# Altium project Fuel Cell Monitor Master.PrjPcb (part 1 of 2)
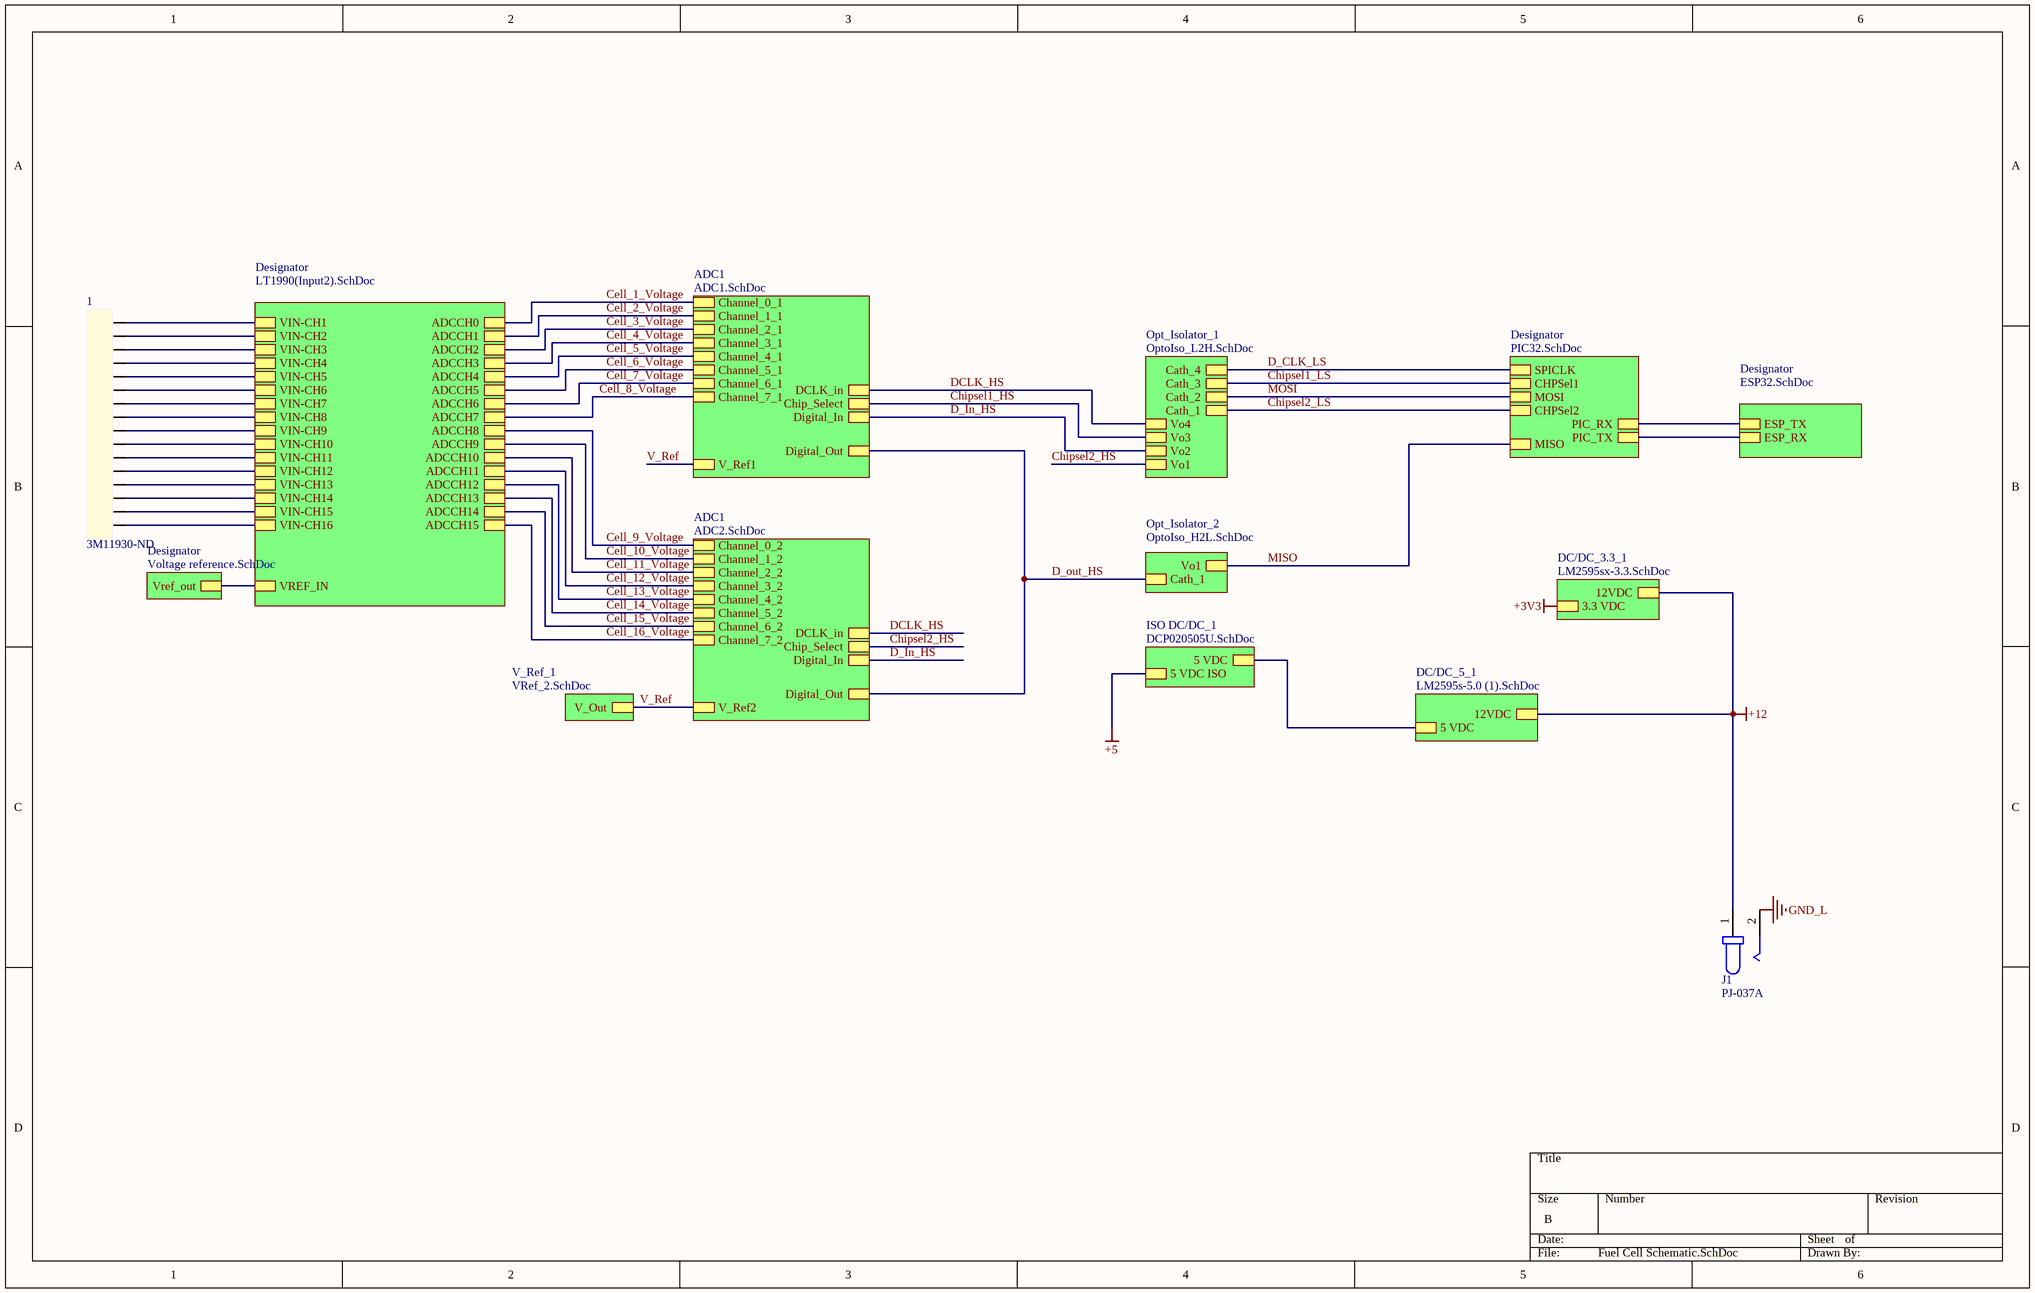
[diagram p0: Fuel Cell Schematic.SchDoc]
11 sheets, 145 parts. Net scope: hierarchical (ports join the sheet entries above them; power ports are global).
Board file: FCM_Integrated.PcbDoc
Sheets:
  Fuel Cell Schematic.SchDoc
    ADC1 = ADC1.SchDoc
    Opt_Isolator_1 = OptoIso_L2H.SchDoc
    Opt_Isolator_2 = OptoIso_H2L.SchDoc
    ADC1 = ADC2.SchDoc
    V_Ref_1 = VRef_2.SchDoc
    Designator = LT1990(Input2).SchDoc
    Designator = Voltage reference.SchDoc
    DC/DC_3.3_1 = LM2595sx-3.3.SchDoc
    ISO DC/DC_1 = DCP020505U.SchDoc
    Designator = PIC32.SchDoc

## Sheet Fuel Cell Schematic.SchDoc
size B; SheetNumber: 1; SheetTotal: 13

### Parts
1  Supplier Part Number 1: 3M11930-ND  [IDC Connector_16POS_2Layer]
J1  PJ-037A  [CUI_PJ-037A]

### Sub-sheets
ADC1 = ADC1.SchDoc: DCLK_in, Chip_Select, Digital_In, Digital_Out, Channel_0_1, Channel_1_1, Channel_2_1, Channel_3_1, Channel_4_1, Channel_5_1, Channel_6_1, Channel_7_1, V_Ref1
ADC1 = ADC2.SchDoc: DCLK_in, Chip_Select, Digital_In, Digital_Out, Channel_0_2, Channel_1_2, Channel_2_2, Channel_3_2, Channel_4_2, Channel_5_2, Channel_6_2, Channel_7_2, V_Ref2
DC/DC_3.3_1 = LM2595sx-3.3.SchDoc: 12VDC, 3.3 VDC
DC/DC_5_1 = LM2595s-5.0 (1).SchDoc (file not in this document): 12VDC, 5 VDC
Designator = LT1990(Input2).SchDoc: ADCCH1, ADCCH2, ADCCH3, VIN-CH3, ADCCH4, VIN-CH4, VIN-CH5, ADCCH5, VIN-CH6, ADCCH6, ADCCH7, ADCCH8, VIN-CH8, ADCCH9, VIN-CH9, ADCCH10, VIN-CH10, ADCCH11, VIN-CH11, ADCCH12, VIN-CH12, ADCCH13, VIN-CH13, ADCCH14, VIN-CH14, ADCCH15, VIN-CH15, VIN-CH16, VIN-CH2, ADCCH0, VIN-CH1, VREF_IN, VIN-CH7
Designator = Voltage reference.SchDoc: Vref_out
Designator = ESP32.SchDoc (file not in this document): ESP_TX, ESP_RX
Designator = PIC32.SchDoc: CHPSel2, MOSI, CHPSel1, PIC_TX, PIC_RX, MISO, SPICLK
ISO DC/DC_1 = DCP020505U.SchDoc: 5 VDC, 5 VDC ISO
Opt_Isolator_1 = OptoIso_L2H.SchDoc: Vo4, Vo3, Vo2, Cath_4, Cath_3, Cath_2, Cath_1, Vo1
Opt_Isolator_2 = OptoIso_H2L.SchDoc: Cath_1, Vo1
V_Ref_1 = VRef_2.SchDoc: V_Out

### Nets
+12: J1.1 ; sheet DC/DC_3.3_1/12VDC, sheet DC/DC_5_1/12VDC
GND_L: J1.2
2.048_VDC: sheet Designator/VREF_IN, sheet Designator/Vref_out
Cell_1_Voltage: sheet ADC1/Channel_0_1, sheet Designator/ADCCH0
Cell_2_Voltage: sheet ADC1/Channel_1_1, sheet Designator/ADCCH1
Cell_3_Voltage: sheet ADC1/Channel_2_1, sheet Designator/ADCCH2
Cell_4_Voltage: sheet ADC1/Channel_3_1, sheet Designator/ADCCH3
Cell_5_Voltage: sheet ADC1/Channel_4_1, sheet Designator/ADCCH4
Cell_6_Voltage: sheet ADC1/Channel_5_1, sheet Designator/ADCCH5
Cell_7_Voltage: sheet ADC1/Channel_6_1, sheet Designator/ADCCH6
Cell_8_Voltage: sheet ADC1/Channel_7_1, sheet Designator/ADCCH7
Cell_9_Voltage: sheet ADC1/Channel_0_2, sheet Designator/ADCCH8
Cell_10_Voltage: sheet ADC1/Channel_1_2, sheet Designator/ADCCH9
Cell_11_Voltage: sheet ADC1/Channel_2_2, sheet Designator/ADCCH10
Cell_12_Voltage: sheet ADC1/Channel_3_2, sheet Designator/ADCCH11
Cell_13_Voltage: sheet ADC1/Channel_4_2, sheet Designator/ADCCH12
Cell_14_Voltage: sheet ADC1/Channel_5_2, sheet Designator/ADCCH13
Cell_15_Voltage: sheet ADC1/Channel_6_2, sheet Designator/ADCCH14
Cell_16_Voltage: sheet ADC1/Channel_7_2, sheet Designator/ADCCH15
Chipsel1_HS: sheet ADC1/Chip_Select, sheet Opt_Isolator_1/Vo3
Chipsel1_LS: sheet Opt_Isolator_1/Cath_3, sheet Designator/CHPSel1
Chipsel2_HS: sheet Opt_Isolator_1/Vo1, sheet ADC1/Chip_Select
Chipsel2_LS: sheet Opt_Isolator_1/Cath_1, sheet Designator/CHPSel2
D_CLK_LS: sheet Opt_Isolator_1/Cath_4, sheet Designator/SPICLK
D_In_HS: sheet ADC1/Digital_In, sheet Opt_Isolator_1/Vo2, sheet ADC1/Digital_In
D_out_HS: sheet ADC1/Digital_Out, sheet Opt_Isolator_2/Cath_1, sheet ADC1/Digital_Out
DCLK_HS: sheet ADC1/DCLK_in, sheet Opt_Isolator_1/Vo4, sheet ADC1/DCLK_in
ESPout-PICin: sheet Designator/ESP_TX, sheet Designator/PIC_RX
MISO: sheet Opt_Isolator_2/Vo1, sheet Designator/MISO  [project net D_out_1L]
MOSI: sheet Opt_Isolator_1/Cath_2, sheet Designator/MOSI  [project net D_in_LS]
PICout-ESPin: sheet Designator/ESP_RX, sheet Designator/PIC_TX
V_Ref: sheet ADC1/V_Ref1, sheet ADC1/V_Ref2, sheet V_Ref_1/V_Out
Net1_1: 1.1 ; sheet Designator/VIN-CH1
Net1_2: 1.2 ; sheet Designator/VIN-CH2
Net1_3: 1.3 ; sheet Designator/VIN-CH3
Net1_4: 1.4 ; sheet Designator/VIN-CH4
Net1_5: 1.5 ; sheet Designator/VIN-CH5
Net1_6: 1.6 ; sheet Designator/VIN-CH6
Net1_7: 1.7 ; sheet Designator/VIN-CH7
Net1_8: 1.8 ; sheet Designator/VIN-CH8
Net1_9: 1.9 ; sheet Designator/VIN-CH9
Net1_10: 1.10 ; sheet Designator/VIN-CH10
Net1_11: 1.11 ; sheet Designator/VIN-CH11
Net1_12: 1.12 ; sheet Designator/VIN-CH12
Net1_13: 1.13 ; sheet Designator/VIN-CH13
Net1_14: 1.14 ; sheet Designator/VIN-CH14
Net1_15: 1.15 ; sheet Designator/VIN-CH15
Net1_16: 1.16 ; sheet Designator/VIN-CH16
NetC9#2_1: sheet ISO DC/DC_1/5 VDC, sheet DC/DC_5_1/5 VDC

### Library data of the parts
1 = 30316-5002HB: Conn Shrouded Header (4 Sides) HDR 16 POS 2.54mm Solder RA Side Entry Thru-Hole Box; Manufacturer: 3M; Gender: Male; Current Rating: 1A; Number of Positions: 16; Connector Type: Male Pin; Row Spacing: 0.1inch; Supplier 1: Digi-Key; Manufacturer Part Number: 30316-5002HB; RoHS: Yes; Category: Connectors; Stock 1: 5922; Pricing 1: 1=1.55000, 10=1.35200, 100=1.20850, 500=1.00712, 1000=0.86325, 5000=0.76541, 10000=0.74815 (USD); Mounting Technology: Through Hole; Contact Plating: Gold; Contact Material: Brass; Color: Black; Housing Material: Polyester; Housing Color: Black; Min Operating Temperature: -55°C; Max Operating Temperature: 105°C; Number of Rows: 2; Termination: Solder; Package Quantity: 1000; Packaging: Bulk; Series: 303; Contact Type: Male Pin; Orientation: Right Angle; Max Current Rating: 1A; Length: 27.9mm; Pitch: 2.54mm; Contact Mating Length: 0.236inch; Depth: 13.26mm; Lead Free: Lead Free; RoHS Compliant: Yes; ComponentLink1URL: https://datasheet.ciiva.com/6832/ts0818-6832733.pdf?src-supplier=Digi-Key; ComponentLink1Description: https://datasheet.ciiva.com/6832/ts0818-6832733.pdf?src-supplier=Digi-Key
J1 = PJ-037A: 2.0 mm Center Pin, 2.5 A, Right Angle, Through Hole, Dc Power Jack Connector; Value: *; Price: None; MP: PJ-037A; Availability: Unavailable; Package: None

## Sheet ADC1.SchDoc
size A; SheetNumber: 7; SheetTotal: 11
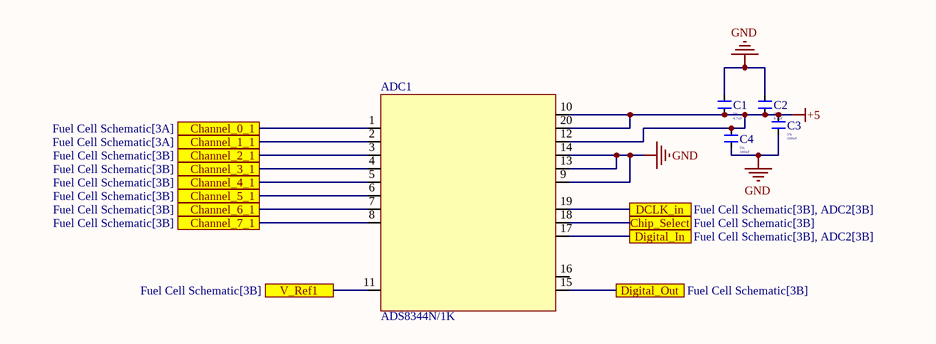
[diagram p1: ADC1.SchDoc]

### Parts
ADC1  ADS8344N/1K  [ADS8344]
C1  Tolerance: 5%  Capacitance: 4.7uF  [Capacitor_Kemet_0805]
C2  Tolerance: 5%  Capacitance: 4.7uF  [Capacitor_Kemet_0805]
C3  Dissipation Factor: 5%  Capacitance: 100nF  [Capacitor_Kemet_0805]
C4  Dissipation Factor: 5%  Capacitance: 100nF  [Capacitor_Kemet_0805]

### Ports
Channel_0_1 (see Fuel Cell Schematic[3A]), Channel_1_1 (see Fuel Cell Schematic[3A]), Channel_2_1 (see Fuel Cell Schematic[3B]), Channel_3_1 (see Fuel Cell Schematic[3B]), Channel_4_1 (see Fuel Cell Schematic[3B]), Channel_5_1 (see Fuel Cell Schematic[3B]), Channel_6_1 (see Fuel Cell Schematic[3B]), Channel_7_1 (see Fuel Cell Schematic[3B]), Chip_Select (see Fuel Cell Schematic[3B]), DCLK_in (see Fuel Cell Schematic[3B], ADC2[3B]), Digital_In (see Fuel Cell Schematic[3B], ADC2[3B]), Digital_Out (see Fuel Cell Schematic[3B]), V_Ref1 (see Fuel Cell Schematic[3B])

### Nets
+5: ADC1.10(Shutdown) ADC1.12(+VCC) ADC1.20(+VCC) C1.1 C2.1 C3.2 C4.2  [project net +5 ISO]
GND: ADC1.9(Common_Reference) ADC1.13(Ground) ADC1.14(Ground) C1.2 C2.2 C3.1 C4.1
Cell_1_Voltage: ADC1.1(Channel_0) ; port Channel_0_1
Cell_2_Voltage: ADC1.2(Channel_1) ; port Channel_1_1
Cell_3_Voltage: ADC1.3(Channel_2) ; port Channel_2_1
Cell_4_Voltage: ADC1.4(Channel_3) ; port Channel_3_1
Cell_5_Voltage: ADC1.5(Channel_4) ; port Channel_4_1
Cell_6_Voltage: ADC1.6(Channel_5) ; port Channel_5_1
Cell_7_Voltage: ADC1.7(Channel_6) ; port Channel_6_1
Cell_8_Voltage: ADC1.8(Channel_7) ; port Channel_7_1
Chipsel1_HS: ADC1.18(Chip_Select) ; port Chip_Select
D_In_HS: ADC1.17(Digital_In) ; port Digital_In
D_out_HS: ADC1.15(Digital_Out) ; port Digital_Out
DCLK_HS: ADC1.19(Digital_Clock) ; port DCLK_in
V_Ref: ADC1.11(V_Reference) ; port V_Ref1

Not connected (* = marked no-connect by the designer): ADC1 16(Busy)

### Library data of the parts
ADC1 = ADS8344N/1K: IC ADC 16BIT SAR 20SSOP; Manufacturer: Texas Instruments; Nominal Supply Current: 1.5mA; Min Supply Voltage: 2.7V; Max Supply Voltage: 5.25V; Max Power Dissipation: 10mW; Interface: Serial; Number of Bits: 16; Sampling Rate: 100KS/s; Number of Converters: 1; Resolution: 16b; Polarity: Unipolar; Number of Inputs: 8; Integral Nonlinearity (INL): 6LSB; Spurious-free dynamic range (SFDR): 92dB; Power Consumption: 3.6mW; Supply Type: Single; Differential Nonlinearity: 2LSB; Power Dissipation: 7.5mW; Operating Supply Voltage: 5V; Supplier 1: Digi-Key; Manufacturer Part Number: ADS8344N/1K; RoHS: Yes; Category: Analog to Digital Converters (ADCs); Stock 1: 1147; Pricing 1: 1=18.10000, 10=16.63400, 25=15.94480, 100=14.04870, 250=13.35924, 500=13.00960 (USD); Case/Package: SSOP; Number of Pins: 20; Contact Plating: Gold; Min Operating Temperature: -40°C; Max Operating Temperature: 85°C; Packaging: Tape and Reel; Package Quantity: 1000; Number of A/D Converters: 1; Conversion Rate: 100KS/s; Max Supply Voltage (DC): 5.25V; Min Supply Voltage (DC): 2.7V; Series: -; Supply Current: 1.5mA; REACH SVHC: No SVHC; Lead Free: Lead Free; RoHS Compliant: Yes; ComponentLink1URL: https://datasheet.ciiva.com/4031/2422049s9164356n7713-4031078.pdf?src-supplier=Arrow+Electronics; ComponentLink1Description: https://datasheet.ciiva.com/4031/2422049s9164356n7713-4031078.pdf?src-supplier=Arrow+Electronics; ComponentLink2URL: https://datasheet.ciiva.com/1308/ads8344-1308384.pdf?src-supplier=Digi-Key; ComponentLink2Description: https://datasheet.ciiva.com/1308/ads8344-1308384.pdf?src-supplier=Digi-Key; Supplier Part Number 1: 296-41197-1-ND
C1 C2 = C0805C475J4RACAUTO: CAP CER 4.7UF 16V X7R 0805; Manufacturer: KEMET; Supplier 1: Digi-Key; RoHS: Yes; Category: Ceramic Capacitors; Stock 1: 16673; Pricing 1: 1=0.56000, 10=0.39300, 50=0.29680, 100=0.25850, 500=0.19150, 1000=0.16277 (USD); Mount: Surface Mount; Case/Package: 0805; Min Operating Temperature: -55°C; Max Operating Temperature: 125°C; Packaging: Tape and Reel; Voltage Rating: 16V; Ratings: AEC-Q200; RoHS Compliant: Yes; ComponentLink1URL: http://www.farnell.com/datasheets/2741387.pdf?src-supplier=Farnell; ComponentLink1Description: http://www.farnell.com/datasheets/2741387.pdf?src-supplier=Farnell; ComponentLink2URL: https://api.kemet.com/component-edge/download/datasheet/C0805C475J4RACAUTO.pdf?src-supplier=Digi-Key; ComponentLink2Description: https://api.kemet.com/component-edge/download/datasheet/C0805C475J4RACAUTO.pdf?src-supplier=Digi-Key; ComponentLink3URL: http://www.farnell.com/datasheets/2741387.pdf?src-supplier=Newark; ComponentLink3Description: http://www.farnell.com/datasheets/2741387.pdf?src-supplier=Newark; Supplier Part Number 1: 399-15716-1-ND; Manufacturer Part Number: C0805C475J4RACAUTO
C3 C4 = C0805C104J4RACTU: Cap Ceramic 0.1uF 16V X7R 5% SMD 0805 125°C Plastic T/R; Manufacturer: KEMET; Supplier 1: Digi-Key; Manufacturer Part Number: C0805C104J4RACTU; RoHS: Yes; Category: Ceramic Capacitors; Stock 1: 21669; Pricing 1: 1=0.53000, 10=0.37300, 50=0.28180, 100=0.24540, 500=0.18180, 1000=0.15453 (USD); Mount: Surface Mount; Case/Package: 0805; Case Code (Imperial): 0805; Case Code (Metric): 2012; Dielectric Material: Ceramic; Min Operating Temperature: -55°C; Max Operating Temperature: 125°C; Package Quantity: 4000; Packaging: Tape and Reel; Voltage Rating: 16V; Voltage Rating (DC): 16V; Dielectric: X7R; Termination: SMD/SMT; Series: -; Length: 2mm; Width: 1.2mm; Height: 0.9mm; Lead Pitch: 0.75mm; Thickness: 0.035inch; Depth: 1.25mm; RoHS Compliant: Yes; ComponentLink1URL: http://www.farnell.com/datasheets/2746326.pdf?src-supplier=Farnell; ComponentLink1Description: http://www.farnell.com/datasheets/2746326.pdf?src-supplier=Farnell; ComponentLink2URL: http://www.farnell.com/datasheets/2323359.pdf?src-supplier=Farnell; ComponentLink2Description: http://www.farnell.com/datasheets/2323359.pdf?src-supplier=Farnell; ComponentLink3URL: http://www.mouser.com/ds/2/212/KEM_C1002_X7R_SMD-1102033.pdf?src-supplier=Mouser; ComponentLink3Description: http://www.mouser.com/ds/2/212/KEM_C1002_X7R_SMD-1102033.pdf?src-supplier=Mouser; ComponentLink4URL: http://components.arrow.com/part/dataview/3452184S4481915N7429?src-supplier=Arrow+Electronics; ComponentLink4Description: http://components.arrow.com/part/dataview/3452184S4481915N7429?src-supplier=Arrow+Electronics; ComponentLink5URL: https://api.kemet.com/component-edge/download/datasheet/C0805C104J4RACTU.pdf?src-supplier=Digi-Key; ComponentLink5Description: https://api.kemet.com/component-edge/download/datasheet/C0805C104J4RACTU.pdf?src-supplier=Digi-Key; ComponentLink6URL: http://www.farnell.com/datasheets/2330568.pdf?src-supplier=Newark; ComponentLink6Description: http://www.farnell.com/datasheets/2330568.pdf?src-supplier=Newark; ComponentLink7URL: http://www.farnell.com/datasheets/2746326.pdf?src-supplier=Newark; ComponentLink7Description: http://www.farnell.com/datasheets/2746326.pdf?src-supplier=Newark; Supplier Part Number 1: 399-C0805C104J4RAC7800CT-ND

## Sheet OptoIso_L2H.SchDoc
size A; SheetNumber: 8; SheetTotal: 11
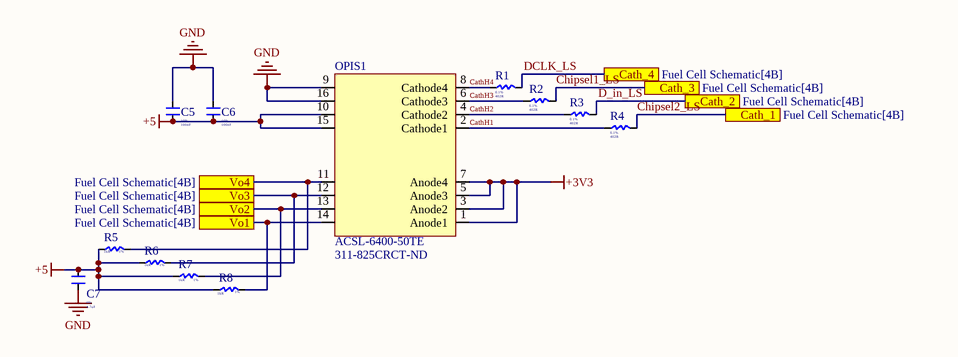
[diagram p2: OptoIso_L2H.SchDoc]

### Parts
(Parts that share a designator on the sheet are numbered #1, #2 ... from top to bottom, then left to right.)
C5#1  Tolerance: 10%  Capacitance: 100nF  [Capacitor_Kemet_0805]
C6#1  Tolerance: 10%  Capacitance: 100nF  [Capacitor_Kemet_0805]
C7#1  Tolerance: 5%  Capacitance: 4.7uF  [Capacitor_Kemet_0805]
OPIS1  Supplier Part Number 2: 311-825CRCT-ND  [Opto_Isolator_ACSL6400_50TE]
R1#1  Tolerance: 0.1%  Resistance: 402R  [LowR_Yageo]
R2#1  Tolerance: 0.1%  Resistance: 402R  [LowR_Yageo]
R3#1  Tolerance: 0.1%  Resistance: 402R  [LowR_Yageo]
R4#1  Tolerance: 0.1%  Resistance: 402R  [LowR_Yageo]
R5#1  Resistance: 1kR  Tolerance: 1%  [Resistor_YAGEO_0805]
R6#1  Resistance: 1kR  Tolerance: 1%  [Resistor_YAGEO_0805]
R7#1  Resistance: 1kR  Tolerance: 1%  [Resistor_YAGEO_0805]
R8#1  Resistance: 1kR  Tolerance: 1%  [Resistor_YAGEO_0805]

### Ports
Cath_1 (see Fuel Cell Schematic[4B]), Cath_2 (see Fuel Cell Schematic[4B]), Cath_3 (see Fuel Cell Schematic[4B]), Cath_4 (see Fuel Cell Schematic[4B]), Vo1 (see Fuel Cell Schematic[4B]), Vo2 (see Fuel Cell Schematic[4B]), Vo3 (see Fuel Cell Schematic[4B]), Vo4 (see Fuel Cell Schematic[4B])

### Nets
+3V3: OPIS1.1(Anode1) OPIS1.3(Anode2) OPIS1.5(Anode3) OPIS1.7(Anode4)
+5: C5#1.2 C6#1.2 C7#1.2 OPIS1.10(VDD) OPIS1.15(VDD) R5#1.1 R6#1.1 R7#1.1 R8#1.1  [project net +5 ISO]
GND: C5#1.1 C6#1.1 C7#1.1 OPIS1.9(Ground) OPIS1.16(Ground)
CathH1: OPIS1.2(Cathode1) R4#1.1
CathH2: OPIS1.4(Cathode2) R3#1.1
CathH3: OPIS1.6(Cathode3) R2#1.1
CathH4: OPIS1.8(Cathode4) R1#1.1
Chipsel1_HS: OPIS1.12(Vo3) R6#1.2 ; port Vo3
Chipsel1_LS: R2#1.2 ; port Cath_3
Chipsel2_HS: OPIS1.14(Vo1) R8#1.2 ; port Vo1
Chipsel2_LS: R4#1.2 ; port Cath_1
D_In_HS: OPIS1.13(Vo2) R7#1.2 ; port Vo2
D_in_LS: R3#1.2 ; port Cath_2
DCLK_HS: OPIS1.11(Vo4) R5#1.2 ; port Vo4
DCLK_LS: R1#1.2 ; port Cath_4  [project net D_CLK_LS]

### Library data of the parts
C5#1 C6#1 = C0805C104K6RACTU: Cap Ceramic 0.1uF 35V X7R 10% SMD 0805 125°C Paper T/R; Manufacturer: KEMET; Supplier 1: Digi-Key; Manufacturer Part Number: C0805C104K6RACTU; RoHS: Yes; Category: Ceramic Capacitors; Stock 1: 14662; Pricing 1: 1=0.44000, 10=0.30300, 50=0.21200, 100=0.18180, 500=0.13636, 1000=0.11514 (USD); Mount: Surface Mount; Case/Package: 0805; Dielectric Material: Ceramic; Min Operating Temperature: -55°C; Max Operating Temperature: 125°C; Packaging: Tape and Reel; Dielectric: X7R; Voltage Rating (DC): 35V; Construction: Flat; Length: 2mm; Height: 0.9mm; Depth: 1.25mm; Radiation Hardening: No; RoHS Compliant: Yes; ComponentLink1URL: http://www.kemet.com/kemet/web/homepage/kechome.nsf/weben/C4DA2DA1D1C9D3C3CA2570A50016092D/$file/KEM_C1002_X7R_SMD.pdf?src-supplier=Avnet; ComponentLink1Description: http://www.kemet.com/kemet/web/homepage/kechome.nsf/weben/C4DA2DA1D1C9D3C3CA2570A50016092D/$file/KEM_C1002_X7R_SMD.pdf?src-supplier=Avnet; ComponentLink2URL: https://api.kemet.com/component-edge/download/datasheet/C0805C104K6RAC7800.pdf?src-supplier=Digi-Key; ComponentLink2Description: https://api.kemet.com/component-edge/download/datasheet/C0805C104K6RAC7800.pdf?src-supplier=Digi-Key; Supplier Part Number 1: 399-17618-1-ND
C7#1 = C0805C475J4RACAUTO: as C1 on sheet ADC1; Supplier 1: Digi-Key; RoHS: Yes; Category: Ceramic Capacitors; Stock 1: 16673; Pricing 1: 1=0.56000, 10=0.39300, 50=0.29680, 100=0.25850, 500=0.19150, 1000=0.16277 (USD); Mount: Surface Mount; Case/Package: 0805; Min Operating Temperature: -55°C; Max Operating Temperature: 125°C; Packaging: Tape and Reel; Voltage Rating: 16V; Ratings: AEC-Q200; RoHS Compliant: Yes; ComponentLink1URL: http://www.farnell.com/datasheets/2741387.pdf?src-supplier=Farnell; ComponentLink1Description: http://www.farnell.com/datasheets/2741387.pdf?src-supplier=Farnell; ComponentLink2URL: https://api.kemet.com/component-edge/download/datasheet/C0805C475J4RACAUTO.pdf?src-supplier=Digi-Key; ComponentLink2Description: https://api.kemet.com/component-edge/download/datasheet/C0805C475J4RACAUTO.pdf?src-supplier=Digi-Key; ComponentLink3URL: http://www.farnell.com/datasheets/2741387.pdf?src-supplier=Newark; ComponentLink3Description: http://www.farnell.com/datasheets/2741387.pdf?src-supplier=Newark; Supplier Part Number 1: 399-15716-1-ND; Manufacturer Part Number: C0805C475J4RACAUTO
OPIS1 = ACSL-6400-50TE: OPTOISO 2.5KV 4CH OPEN COLL 16SO; Manufacturer: Broadcom Avago; Forward Voltage: 1.8V; Forward Current: 15mA; Output Current: 50mA; Propagation Delay: 100ns; Reverse Breakdown Voltage: 5V; Max Power Dissipation: 40mW; Rise Time: 35ns; Number of Channels: 4; Fall Time: 12ns; Power Dissipation: 65mW; Data Rate: 15Mbps; Output Voltage: 7V; Input Type: DC; Supplier 1: Digi-Key; RoHS: Yes; Category: Optocouplers; Stock 1: 12687; Pricing 1: 1=10.50000, 10=7.61700, 100=6.29380, 500=5.51204 (USD); Mount: Surface Mount; Case/Package: SOIC; Number of Pins: 16; Contact Plating: Tin,Matte; Min Operating Temperature: -40°C; Max Operating Temperature: 100°C; Packaging: Tape and Reel; Max Output Current: 50mA; Package Quantity: 1000; Output Current per Channel: 50mA; Number of Elements: 4; Turn-On Delay Time: 100ns; Isolation Voltage: 2.5kV; Input Current: 15mA; Series: -; Radiation Hardening: No; REACH SVHC: No SVHC; Lead Free: Lead Free; RoHS Compliant: Yes; ComponentLink1URL: http://components.arrow.com/part/dataview/41316762S9676761N7786?src-supplier=Arrow+Electronics; ComponentLink1Description: http://components.arrow.com/part/dataview/41316762S9676761N7786?src-supplier=Arrow+Electronics; ComponentLink2URL: http://www.farnell.com/datasheets/1790955.pdf?src-supplier=Farnell; ComponentLink2Description: http://www.farnell.com/datasheets/1790955.pdf?src-supplier=Farnell; ComponentLink3URL: https://www.verical.com/server-webapp/html/getDatasheet?partID=300680&src-supplier=Verical; ComponentLink3Description: https://www.verical.com/server-webapp/html/getDatasheet?partID=300680&src-supplier=Verical; ComponentLink4URL: http://www.avagotech.com/docs/AV02-0235EN?src-supplier=Avnet; ComponentLink4Description: http://www.avagotech.com/docs/AV02-0235EN?src-supplier=Avnet; ComponentLink5URL: http://www.avagotech.com/docs/AV02-0235EN?src-supplier=Digi-Key; ComponentLink5Description: http://www.avagotech.com/docs/AV02-0235EN?src-supplier=Digi-Key; ComponentLink6URL: https://docs.broadcom.com/docs/AV02-0235EN?src-supplier=Digi-Key; ComponentLink6Description: https://docs.broadcom.com/docs/AV02-0235EN?src-supplier=Digi-Key; ComponentLink7URL: http://www.farnell.com/datasheets/1790955.pdf?src-supplier=Newark; ComponentLink7Description: http://www.farnell.com/datasheets/1790955.pdf?src-supplier=Newark; ComponentLink8URL: http://www.farnell.com/datasheets/1790955.pdf?src-supplier=Element14; ComponentLink8Description: http://www.farnell.com/datasheets/1790955.pdf?src-supplier=Element14; ComponentLink9URL: http://www.avagotech.com/search/results.jsp?src=&siteCriteria=ACSL6400&src-supplier=Mouser; ComponentLink9Description: http://www.avagotech.com/search/results.jsp?src=&siteCriteria=ACSL6400&src-supplier=Mouser; Supplier Part Number 1: 516-2917-1-ND; Supplier 2: Digi-Key; Manufacturer Part Number: ACSL-6400-50TE
R1#1 R2#1 R3#1 R4#1 = RT0805BRD07402RL: Res Thin Film 0805 402 Ohm 0.1% 1/8W ±25ppm/°C Molded SMD Paper T/R; Manufacturer: Yageo; Voltage Rating: 150V; Power Rating: 125mW; Supplier 1: Digi-Key; Manufacturer Part Number: RT0805BRD07402RL; RoHS: Yes; Category: Chip SMD Resistors; Stock 1: 13492; Pricing 1: 1=0.38000, 10=0.27200, 100=0.10870, 1000=0.05357, 2500=0.04963 (USD); Case/Package: 0805; Case Code (Metric): 2012; Case Code (Imperial): 0805; Min Operating Temperature: -55°C; Max Operating Temperature: 125°C; Packaging: Tape and Reel; Termination: SMD/SMT; Temperature Coefficient: 25ppm/°C; Voltage Rating (DC): 150V; Series: RT; Length: 2mm; Width: 1.25mm; Height: 500um; Lead Free: Lead Free; RoHS Compliant: Yes; ComponentLink1URL: https://datasheet.ciiva.com/12706/pyu-rt-1-to-0-05-rohs-l-4-12706505.pdf?src-supplier=Mouser; ComponentLink1Description: https://datasheet.ciiva.com/12706/pyu-rt-1-to-0-05-rohs-l-4-12706505.pdf?src-supplier=Mouser; Supplier Part Number 1: YAG4897CT-ND
R5#1 R6#1 R7#1 R8#1 = RC0805FR-071KP: Res Thick Film 0805 1K Ohm 1% 0.125W(1/8W) ±100ppm/C Pad SMD T/R; Manufacturer: Yageo; Max Power Dissipation: 125mW; Temperature Coefficient: 100ppm/°C; Supplier 1: Digi-Key; Manufacturer Part Number: RC0805FR-071KP; RoHS: Yes; Category: Chip SMD Resistors; Stock 1: 37560; Pricing 1: 1=0.10000, 10=0.06400, 100=0.02600, 1000=0.01168, 2500=0.01014 (USD); Case/Package: 0805; Case Code (Metric): 2012; Case Code (Imperial): 0805; Min Operating Temperature: -55°C; Max Operating Temperature: 155°C; Packaging: Tape and Reel; Resistor Type: Thick Film; Number of Terminations: 2; Features: Moisture Resistant; Length: 0.079inch; Width: 0.049inch; Height: 0.024inch; RoHS Compliant: Yes; ComponentLink1URL: http://www.yageo.com/NewPortal/yageodocoutput?fileName=/pdf/R-Chip/PYu-RC_51_RoHS_P_0.pdf&src-supplier=Digi-Key; ComponentLink1Description: http://www.yageo.com/NewPortal/yageodocoutput?fileName=/pdf/R-Chip/PYu-RC_51_RoHS_P_0.pdf&src-supplier=Digi-Key; ComponentLink2URL: http://www.yageo.com.tw/exep/pages/download/literatures/PYu-R_INT-thick_7.pdf?src-supplier=Digi-Key; ComponentLink2Description: http://www.yageo.com.tw/exep/pages/download/literatures/PYu-R_INT-thick_7.pdf?src-supplier=Digi-Key; Supplier Part Number 1: YAG1321CT-ND

## Sheet OptoIso_H2L.SchDoc
size A; SheetNumber: 8; SheetTotal: 11
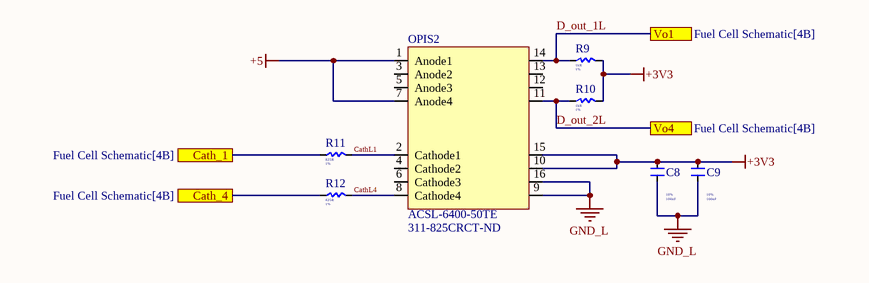
[diagram p3: OptoIso_H2L.SchDoc]

### Parts
(Parts that share a designator on the sheet are numbered #1, #2 ... from top to bottom, then left to right.)
C8#1  Tolerance: 10%  Capacitance: 100nF  [Capacitor_Kemet_0805]
C9#1  Tolerance: 10%  Capacitance: 100nF  [Capacitor_Kemet_0805]
OPIS2  Supplier Part Number 2: 311-825CRCT-ND  [Opto_Isolator_ACSL6400_50TE]
R9#1  Resistance: 1kR  Tolerance: 1%  [Resistor_YAGEO_0805]
R10#1  Resistance: 1kR  Tolerance: 1%  [Resistor_YAGEO_0805]
R11#1  Resistance: 825R  Tolerance: 1%  [Resistor_YAGEO_0805]
R12#1  Resistance: 825R  Tolerance: 1%  [Resistor_YAGEO_0805]

### Ports
Cath_1 (see Fuel Cell Schematic[4B]), Cath_4 (see Fuel Cell Schematic[4B]), Vo1 (see Fuel Cell Schematic[4B]), Vo4 (see Fuel Cell Schematic[4B])

### Nets
+3V3: C8#1.2 C9#1.2 OPIS2.10(VDD) OPIS2.15(VDD) R9#1.2 R10#1.2
+5: OPIS2.1(Anode1) OPIS2.7(Anode4)  [project net +5 ISO]
GND_L: C8#1.1 C9#1.1 OPIS2.9(Ground) OPIS2.16(Ground)
CathL1: OPIS2.2(Cathode1) R11#1.2
CathL4: OPIS2.8(Cathode4) R12#1.2
D_out_1L: OPIS2.14(Vo1) R9#1.1 ; port Vo1
D_out_2L: OPIS2.11(Vo4) R10#1.1 ; port Vo4
D_out_HS: R11#1.1 ; port Cath_1
NetR12#1_1: R12#1.1 ; port Cath_4

Not connected (* = marked no-connect by the designer): OPIS2 3(Anode2) 4(Cathode2) 5(Anode3) 6(Cathode3) 12(Vo3) 13(Vo2)

### Library data of the parts
C8#1 C9#1 = C0805C104K6RACTU: as C5#1 on sheet OptoIso_L2H; Supplier 1: Digi-Key; Manufacturer Part Number: C0805C104K6RACTU; RoHS: Yes; Category: Ceramic Capacitors; Stock 1: 14662; Pricing 1: 1=0.44000, 10=0.30300, 50=0.21200, 100=0.18180, 500=0.13636, 1000=0.11514 (USD); Mount: Surface Mount; Case/Package: 0805; Dielectric Material: Ceramic; Min Operating Temperature: -55°C; Max Operating Temperature: 125°C; Packaging: Tape and Reel; Dielectric: X7R; Voltage Rating (DC): 35V; Construction: Flat; Length: 2mm; Height: 0.9mm; Depth: 1.25mm; Radiation Hardening: No; RoHS Compliant: Yes; ComponentLink1URL: http://www.kemet.com/kemet/web/homepage/kechome.nsf/weben/C4DA2DA1D1C9D3C3CA2570A50016092D/$file/KEM_C1002_X7R_SMD.pdf?src-supplier=Avnet; ComponentLink1Description: http://www.kemet.com/kemet/web/homepage/kechome.nsf/weben/C4DA2DA1D1C9D3C3CA2570A50016092D/$file/KEM_C1002_X7R_SMD.pdf?src-supplier=Avnet; ComponentLink2URL: https://api.kemet.com/component-edge/download/datasheet/C0805C104K6RAC7800.pdf?src-supplier=Digi-Key; ComponentLink2Description: https://api.kemet.com/component-edge/download/datasheet/C0805C104K6RAC7800.pdf?src-supplier=Digi-Key; Supplier Part Number 1: 399-17618-1-ND
OPIS2 = ACSL-6400-50TE: as OPIS1 on sheet OptoIso_L2H; Supplier 1: Digi-Key; RoHS: Yes; Category: Optocouplers; Stock 1: 12687; Pricing 1: 1=10.50000, 10=7.61700, 100=6.29380, 500=5.51204 (USD); Mount: Surface Mount; Case/Package: SOIC; Number of Pins: 16; Contact Plating: Tin,Matte; Min Operating Temperature: -40°C; Max Operating Temperature: 100°C; Packaging: Tape and Reel; Max Output Current: 50mA; Package Quantity: 1000; Output Current per Channel: 50mA; Number of Elements: 4; Turn-On Delay Time: 100ns; Isolation Voltage: 2.5kV; Input Current: 15mA; Series: -; Radiation Hardening: No; REACH SVHC: No SVHC; Lead Free: Lead Free; RoHS Compliant: Yes; ComponentLink1URL: http://components.arrow.com/part/dataview/41316762S9676761N7786?src-supplier=Arrow+Electronics; ComponentLink1Description: http://components.arrow.com/part/dataview/41316762S9676761N7786?src-supplier=Arrow+Electronics; ComponentLink2URL: http://www.farnell.com/datasheets/1790955.pdf?src-supplier=Farnell; ComponentLink2Description: http://www.farnell.com/datasheets/1790955.pdf?src-supplier=Farnell; ComponentLink3URL: https://www.verical.com/server-webapp/html/getDatasheet?partID=300680&src-supplier=Verical; ComponentLink3Description: https://www.verical.com/server-webapp/html/getDatasheet?partID=300680&src-supplier=Verical; ComponentLink4URL: http://www.avagotech.com/docs/AV02-0235EN?src-supplier=Avnet; ComponentLink4Description: http://www.avagotech.com/docs/AV02-0235EN?src-supplier=Avnet; ComponentLink5URL: http://www.avagotech.com/docs/AV02-0235EN?src-supplier=Digi-Key; ComponentLink5Description: http://www.avagotech.com/docs/AV02-0235EN?src-supplier=Digi-Key; ComponentLink6URL: https://docs.broadcom.com/docs/AV02-0235EN?src-supplier=Digi-Key; ComponentLink6Description: https://docs.broadcom.com/docs/AV02-0235EN?src-supplier=Digi-Key; ComponentLink7URL: http://www.farnell.com/datasheets/1790955.pdf?src-supplier=Newark; ComponentLink7Description: http://www.farnell.com/datasheets/1790955.pdf?src-supplier=Newark; ComponentLink8URL: http://www.farnell.com/datasheets/1790955.pdf?src-supplier=Element14; ComponentLink8Description: http://www.farnell.com/datasheets/1790955.pdf?src-supplier=Element14; ComponentLink9URL: http://www.avagotech.com/search/results.jsp?src=&siteCriteria=ACSL6400&src-supplier=Mouser; ComponentLink9Description: http://www.avagotech.com/search/results.jsp?src=&siteCriteria=ACSL6400&src-supplier=Mouser; Supplier Part Number 1: 516-2917-1-ND; Supplier 2: Digi-Key; Manufacturer Part Number: ACSL-6400-50TE
R9#1 R10#1 = RC0805FR-071KP: as R5#1 on sheet OptoIso_L2H; Supplier 1: Digi-Key; Manufacturer Part Number: RC0805FR-071KP; RoHS: Yes; Category: Chip SMD Resistors; Stock 1: 37560; Pricing 1: 1=0.10000, 10=0.06400, 100=0.02600, 1000=0.01168, 2500=0.01014 (USD); Case/Package: 0805; Case Code (Metric): 2012; Case Code (Imperial): 0805; Min Operating Temperature: -55°C; Max Operating Temperature: 155°C; Packaging: Tape and Reel; Resistor Type: Thick Film; Number of Terminations: 2; Features: Moisture Resistant; Length: 0.079inch; Width: 0.049inch; Height: 0.024inch; RoHS Compliant: Yes; ComponentLink1URL: http://www.yageo.com/NewPortal/yageodocoutput?fileName=/pdf/R-Chip/PYu-RC_51_RoHS_P_0.pdf&src-supplier=Digi-Key; ComponentLink1Description: http://www.yageo.com/NewPortal/yageodocoutput?fileName=/pdf/R-Chip/PYu-RC_51_RoHS_P_0.pdf&src-supplier=Digi-Key; ComponentLink2URL: http://www.yageo.com.tw/exep/pages/download/literatures/PYu-R_INT-thick_7.pdf?src-supplier=Digi-Key; ComponentLink2Description: http://www.yageo.com.tw/exep/pages/download/literatures/PYu-R_INT-thick_7.pdf?src-supplier=Digi-Key; Supplier Part Number 1: YAG1321CT-ND
R11#1 R12#1 = RC0805FR-07825RL: 825 Ohms ±1% 0.125W, 1/8W Chip Resistor 0805 (2012 Metric) Moisture Resistant Thick Film; Manufacturer: Yageo; Voltage Rating (DC): 150V; Power Rating: 125mW; Temperature Coefficient: 100ppm/°C; Supplier 1: Digi-Key; Manufacturer Part Number: RC0805FR-07825RL; RoHS: Yes; Category: Chip SMD Resistors; Stock 1: 643539; Pricing 1: 1=0.10000, 10=0.03700, 100=0.01510, 1000=0.00680, 2500=0.00590 (USD); Case/Package: 0805; Case Code (Imperial): 0805; Case Code (Metric): 2012; Contact Plating: Tin,Matte,Lead; Min Operating Temperature: -55°C; Max Operating Temperature: 155°C; Packaging: Tape and Reel; Features: Moisture Resistant; Series: RC; Voltage Rating: 150V; Termination: SMD/SMT; Resistor Type: Thick Film; Number of Terminations: 2; Max Power Dissipation: 125mW; Construction: Rectangular; Working Voltage: 150V; Technology: THICK FILM; Length: 2mm; Depth: 1.25mm; Radiation Hardening: No; Lead Free: Lead Free; RoHS Compliant: Yes; Military Standard: Not; ComponentLink1URL: https://datasheet.ciiva.com/16741/rc0805-16741467.pdf?src-supplier=Future+Electronics; ComponentLink1Description: https://datasheet.ciiva.com/16741/rc0805-16741467.pdf?src-supplier=Future+Electronics; Supplier Part Number 1: 311-825CRCT-ND

## Sheet ADC2.SchDoc
size A; SheetNumber: 11; SheetTotal: 11
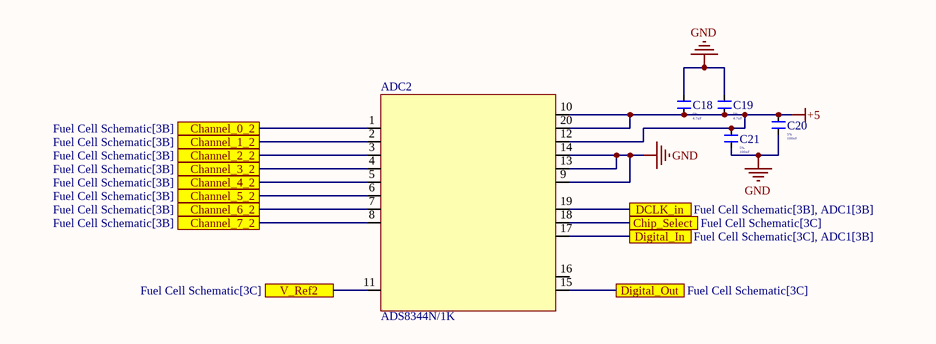
[diagram p4: ADC2.SchDoc]

### Parts
(Parts that share a designator on the sheet are numbered #1, #2 ... from top to bottom, then left to right.)
ADC2  ADS8344N/1K  [ADS8344]
C18#1  Tolerance: 5%  Capacitance: 4.7uF  [Capacitor_Kemet_0805]
C19#1  Tolerance: 5%  Capacitance: 4.7uF  [Capacitor_Kemet_0805]
C20#1  Dissipation Factor: 5%  Capacitance: 100nF  [Capacitor_Kemet_0805]
C21#1  Dissipation Factor: 5%  Capacitance: 100nF  [Capacitor_Kemet_0805]

### Ports
Channel_0_2 (see Fuel Cell Schematic[3B]), Channel_1_2 (see Fuel Cell Schematic[3B]), Channel_2_2 (see Fuel Cell Schematic[3B]), Channel_3_2 (see Fuel Cell Schematic[3B]), Channel_4_2 (see Fuel Cell Schematic[3B]), Channel_5_2 (see Fuel Cell Schematic[3B]), Channel_6_2 (see Fuel Cell Schematic[3B]), Channel_7_2 (see Fuel Cell Schematic[3B]), Chip_Select (see Fuel Cell Schematic[3C]), DCLK_in (see Fuel Cell Schematic[3B], ADC1[3B]), Digital_In (see Fuel Cell Schematic[3C], ADC1[3B]), Digital_Out (see Fuel Cell Schematic[3C]), V_Ref2 (see Fuel Cell Schematic[3C])

### Nets
+5: ADC2.10(Shutdown) ADC2.12(+VCC) ADC2.20(+VCC) C18#1.1 C19#1.1 C20#1.2 C21#1.2  [project net +5 ISO]
GND: ADC2.9(Common_Reference) ADC2.13(Ground) ADC2.14(Ground) C18#1.2 C19#1.2 C20#1.1 C21#1.1
Cell_9_Voltage: ADC2.1(Channel_0) ; port Channel_0_2
Cell_10_Voltage: ADC2.2(Channel_1) ; port Channel_1_2
Cell_11_Voltage: ADC2.3(Channel_2) ; port Channel_2_2
Cell_12_Voltage: ADC2.4(Channel_3) ; port Channel_3_2
Cell_13_Voltage: ADC2.5(Channel_4) ; port Channel_4_2
Cell_14_Voltage: ADC2.6(Channel_5) ; port Channel_5_2
Cell_15_Voltage: ADC2.7(Channel_6) ; port Channel_6_2
Cell_16_Voltage: ADC2.8(Channel_7) ; port Channel_7_2
Chipsel2_HS: ADC2.18(Chip_Select) ; port Chip_Select
D_In_HS: ADC2.17(Digital_In) ; port Digital_In
D_out_HS: ADC2.15(Digital_Out) ; port Digital_Out
DCLK_HS: ADC2.19(Digital_Clock) ; port DCLK_in
V_Ref: ADC2.11(V_Reference) ; port V_Ref2

Not connected (* = marked no-connect by the designer): ADC2 16(Busy)

### Library data of the parts
ADC2 = ADS8344N/1K: as ADC1 on sheet ADC1; Supplier 1: Digi-Key; Manufacturer Part Number: ADS8344N/1K; RoHS: Yes; Category: Analog to Digital Converters (ADCs); Stock 1: 1147; Pricing 1: 1=18.10000, 10=16.63400, 25=15.94480, 100=14.04870, 250=13.35924, 500=13.00960 (USD); Case/Package: SSOP; Number of Pins: 20; Contact Plating: Gold; Min Operating Temperature: -40°C; Max Operating Temperature: 85°C; Packaging: Tape and Reel; Package Quantity: 1000; Number of A/D Converters: 1; Conversion Rate: 100KS/s; Max Supply Voltage (DC): 5.25V; Min Supply Voltage (DC): 2.7V; Series: -; Supply Current: 1.5mA; REACH SVHC: No SVHC; Lead Free: Lead Free; RoHS Compliant: Yes; ComponentLink1URL: https://datasheet.ciiva.com/4031/2422049s9164356n7713-4031078.pdf?src-supplier=Arrow+Electronics; ComponentLink1Description: https://datasheet.ciiva.com/4031/2422049s9164356n7713-4031078.pdf?src-supplier=Arrow+Electronics; ComponentLink2URL: https://datasheet.ciiva.com/1308/ads8344-1308384.pdf?src-supplier=Digi-Key; ComponentLink2Description: https://datasheet.ciiva.com/1308/ads8344-1308384.pdf?src-supplier=Digi-Key; Supplier Part Number 1: 296-41197-1-ND
C18#1 C19#1 = C0805C475J4RACAUTO: as C1 on sheet ADC1; Supplier 1: Digi-Key; RoHS: Yes; Category: Ceramic Capacitors; Stock 1: 16673; Pricing 1: 1=0.56000, 10=0.39300, 50=0.29680, 100=0.25850, 500=0.19150, 1000=0.16277 (USD); Mount: Surface Mount; Case/Package: 0805; Min Operating Temperature: -55°C; Max Operating Temperature: 125°C; Packaging: Tape and Reel; Voltage Rating: 16V; Ratings: AEC-Q200; RoHS Compliant: Yes; ComponentLink1URL: http://www.farnell.com/datasheets/2741387.pdf?src-supplier=Farnell; ComponentLink1Description: http://www.farnell.com/datasheets/2741387.pdf?src-supplier=Farnell; ComponentLink2URL: https://api.kemet.com/component-edge/download/datasheet/C0805C475J4RACAUTO.pdf?src-supplier=Digi-Key; ComponentLink2Description: https://api.kemet.com/component-edge/download/datasheet/C0805C475J4RACAUTO.pdf?src-supplier=Digi-Key; ComponentLink3URL: http://www.farnell.com/datasheets/2741387.pdf?src-supplier=Newark; ComponentLink3Description: http://www.farnell.com/datasheets/2741387.pdf?src-supplier=Newark; Supplier Part Number 1: 399-15716-1-ND; Manufacturer Part Number: C0805C475J4RACAUTO
C20#1 C21#1 = C0805C104J4RACTU: as C3 on sheet ADC1; Supplier 1: Digi-Key; Manufacturer Part Number: C0805C104J4RACTU; RoHS: Yes; Category: Ceramic Capacitors; Stock 1: 21669; Pricing 1: 1=0.53000, 10=0.37300, 50=0.28180, 100=0.24540, 500=0.18180, 1000=0.15453 (USD); Mount: Surface Mount; Case/Package: 0805; Case Code (Imperial): 0805; Case Code (Metric): 2012; Dielectric Material: Ceramic; Min Operating Temperature: -55°C; Max Operating Temperature: 125°C; Package Quantity: 4000; Packaging: Tape and Reel; Voltage Rating: 16V; Voltage Rating (DC): 16V; Dielectric: X7R; Termination: SMD/SMT; Series: -; Length: 2mm; Width: 1.2mm; Height: 0.9mm; Lead Pitch: 0.75mm; Thickness: 0.035inch; Depth: 1.25mm; RoHS Compliant: Yes; ComponentLink1URL: http://www.farnell.com/datasheets/2746326.pdf?src-supplier=Farnell; ComponentLink1Description: http://www.farnell.com/datasheets/2746326.pdf?src-supplier=Farnell; ComponentLink2URL: http://www.farnell.com/datasheets/2323359.pdf?src-supplier=Farnell; ComponentLink2Description: http://www.farnell.com/datasheets/2323359.pdf?src-supplier=Farnell; ComponentLink3URL: http://www.mouser.com/ds/2/212/KEM_C1002_X7R_SMD-1102033.pdf?src-supplier=Mouser; ComponentLink3Description: http://www.mouser.com/ds/2/212/KEM_C1002_X7R_SMD-1102033.pdf?src-supplier=Mouser; ComponentLink4URL: http://components.arrow.com/part/dataview/3452184S4481915N7429?src-supplier=Arrow+Electronics; ComponentLink4Description: http://components.arrow.com/part/dataview/3452184S4481915N7429?src-supplier=Arrow+Electronics; ComponentLink5URL: https://api.kemet.com/component-edge/download/datasheet/C0805C104J4RACTU.pdf?src-supplier=Digi-Key; ComponentLink5Description: https://api.kemet.com/component-edge/download/datasheet/C0805C104J4RACTU.pdf?src-supplier=Digi-Key; ComponentLink6URL: http://www.farnell.com/datasheets/2330568.pdf?src-supplier=Newark; ComponentLink6Description: http://www.farnell.com/datasheets/2330568.pdf?src-supplier=Newark; ComponentLink7URL: http://www.farnell.com/datasheets/2746326.pdf?src-supplier=Newark; ComponentLink7Description: http://www.farnell.com/datasheets/2746326.pdf?src-supplier=Newark; Supplier Part Number 1: 399-C0805C104J4RAC7800CT-ND

## Sheet VRef_2.SchDoc
size A; SheetNumber: 10; SheetTotal: 11
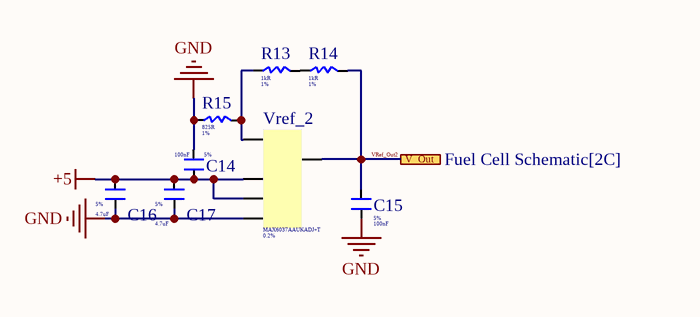
[diagram p5: VRef_2.SchDoc]

### Parts
(Parts that share a designator on the sheet are numbered #1, #2 ... from top to bottom, then left to right.)
C14#1  Dissipation Factor: 5%  Capacitance: 100nF  [Capacitor_Kemet_0805]
C15#1  Dissipation Factor: 5%  Capacitance: 100nF  [Capacitor_Kemet_0805]
C16#1  Tolerance: 5%  Capacitance: 4.7uF  [Capacitor_Kemet_0805]
C17#1  Tolerance: 5%  Capacitance: 4.7uF  [Capacitor_Kemet_0805]
R13#1  Resistance: 1kR  Tolerance: 1%  [Resistor_YAGEO_0805]
R14#1  Resistance: 1kR  Tolerance: 1%  [Resistor_YAGEO_0805]
R15#1  Resistance: 825R  Tolerance: 1%  [Resistor_YAGEO_0805]
Vref_2  Tolerance: 0.2%  [VRef]

### Ports
V_Out (see Fuel Cell Schematic[2C])

### Nets
+5: C14#1.1 C16#1.2 C17#1.2 Vref_2.3(SHDN) Vref_2.4(In)  [project net +5 ISO]
GND: C14#1.2 C15#1.1 C16#1.1 C17#1.1 R15#1.1 Vref_2.2(GND)
VRef_Out2: C15#1.2 R14#1.2 Vref_2.5(OUT) ; port V_Out  [project net V_Ref]
NetR13#1_1: R13#1.1 R15#1.2 Vref_2.1(ADJ)
NetR13#1_2: R13#1.2 R14#1.1

### Library data of the parts
C14#1 C15#1 = C0805C104J4RACTU: as C3 on sheet ADC1; Supplier 1: Digi-Key; Manufacturer Part Number: C0805C104J4RACTU; RoHS: Yes; Category: Ceramic Capacitors; Stock 1: 21669; Pricing 1: 1=0.53000, 10=0.37300, 50=0.28180, 100=0.24540, 500=0.18180, 1000=0.15453 (USD); Mount: Surface Mount; Case/Package: 0805; Case Code (Imperial): 0805; Case Code (Metric): 2012; Dielectric Material: Ceramic; Min Operating Temperature: -55°C; Max Operating Temperature: 125°C; Package Quantity: 4000; Packaging: Tape and Reel; Voltage Rating: 16V; Voltage Rating (DC): 16V; Dielectric: X7R; Termination: SMD/SMT; Series: -; Length: 2mm; Width: 1.2mm; Height: 0.9mm; Lead Pitch: 0.75mm; Thickness: 0.035inch; Depth: 1.25mm; RoHS Compliant: Yes; ComponentLink1URL: http://www.farnell.com/datasheets/2746326.pdf?src-supplier=Farnell; ComponentLink1Description: http://www.farnell.com/datasheets/2746326.pdf?src-supplier=Farnell; ComponentLink2URL: http://www.farnell.com/datasheets/2323359.pdf?src-supplier=Farnell; ComponentLink2Description: http://www.farnell.com/datasheets/2323359.pdf?src-supplier=Farnell; ComponentLink3URL: http://www.mouser.com/ds/2/212/KEM_C1002_X7R_SMD-1102033.pdf?src-supplier=Mouser; ComponentLink3Description: http://www.mouser.com/ds/2/212/KEM_C1002_X7R_SMD-1102033.pdf?src-supplier=Mouser; ComponentLink4URL: http://components.arrow.com/part/dataview/3452184S4481915N7429?src-supplier=Arrow+Electronics; ComponentLink4Description: http://components.arrow.com/part/dataview/3452184S4481915N7429?src-supplier=Arrow+Electronics; ComponentLink5URL: https://api.kemet.com/component-edge/download/datasheet/C0805C104J4RACTU.pdf?src-supplier=Digi-Key; ComponentLink5Description: https://api.kemet.com/component-edge/download/datasheet/C0805C104J4RACTU.pdf?src-supplier=Digi-Key; ComponentLink6URL: http://www.farnell.com/datasheets/2330568.pdf?src-supplier=Newark; ComponentLink6Description: http://www.farnell.com/datasheets/2330568.pdf?src-supplier=Newark; ComponentLink7URL: http://www.farnell.com/datasheets/2746326.pdf?src-supplier=Newark; ComponentLink7Description: http://www.farnell.com/datasheets/2746326.pdf?src-supplier=Newark; Supplier Part Number 1: 399-C0805C104J4RAC7800CT-ND
C16#1 C17#1 = C0805C475J4RACAUTO: as C1 on sheet ADC1; Supplier 1: Digi-Key; RoHS: Yes; Category: Ceramic Capacitors; Stock 1: 16673; Pricing 1: 1=0.56000, 10=0.39300, 50=0.29680, 100=0.25850, 500=0.19150, 1000=0.16277 (USD); Mount: Surface Mount; Case/Package: 0805; Min Operating Temperature: -55°C; Max Operating Temperature: 125°C; Packaging: Tape and Reel; Voltage Rating: 16V; Ratings: AEC-Q200; RoHS Compliant: Yes; ComponentLink1URL: http://www.farnell.com/datasheets/2741387.pdf?src-supplier=Farnell; ComponentLink1Description: http://www.farnell.com/datasheets/2741387.pdf?src-supplier=Farnell; ComponentLink2URL: https://api.kemet.com/component-edge/download/datasheet/C0805C475J4RACAUTO.pdf?src-supplier=Digi-Key; ComponentLink2Description: https://api.kemet.com/component-edge/download/datasheet/C0805C475J4RACAUTO.pdf?src-supplier=Digi-Key; ComponentLink3URL: http://www.farnell.com/datasheets/2741387.pdf?src-supplier=Newark; ComponentLink3Description: http://www.farnell.com/datasheets/2741387.pdf?src-supplier=Newark; Supplier Part Number 1: 399-15716-1-ND; Manufacturer Part Number: C0805C475J4RACAUTO
R13#1 R14#1 = RC0805FR-071KP: as R5#1 on sheet OptoIso_L2H; Supplier 1: Digi-Key; Manufacturer Part Number: RC0805FR-071KP; RoHS: Yes; Category: Chip SMD Resistors; Stock 1: 37560; Pricing 1: 1=0.10000, 10=0.06400, 100=0.02600, 1000=0.01168, 2500=0.01014 (USD); Case/Package: 0805; Case Code (Metric): 2012; Case Code (Imperial): 0805; Min Operating Temperature: -55°C; Max Operating Temperature: 155°C; Packaging: Tape and Reel; Resistor Type: Thick Film; Number of Terminations: 2; Features: Moisture Resistant; Length: 0.079inch; Width: 0.049inch; Height: 0.024inch; RoHS Compliant: Yes; ComponentLink1URL: http://www.yageo.com/NewPortal/yageodocoutput?fileName=/pdf/R-Chip/PYu-RC_51_RoHS_P_0.pdf&src-supplier=Digi-Key; ComponentLink1Description: http://www.yageo.com/NewPortal/yageodocoutput?fileName=/pdf/R-Chip/PYu-RC_51_RoHS_P_0.pdf&src-supplier=Digi-Key; ComponentLink2URL: http://www.yageo.com.tw/exep/pages/download/literatures/PYu-R_INT-thick_7.pdf?src-supplier=Digi-Key; ComponentLink2Description: http://www.yageo.com.tw/exep/pages/download/literatures/PYu-R_INT-thick_7.pdf?src-supplier=Digi-Key; Supplier Part Number 1: YAG1321CT-ND
R15#1 = RC0805FR-07825RL: as R11#1 on sheet OptoIso_H2L; Supplier 1: Digi-Key; Manufacturer Part Number: RC0805FR-07825RL; RoHS: Yes; Category: Chip SMD Resistors; Stock 1: 643539; Pricing 1: 1=0.10000, 10=0.03700, 100=0.01510, 1000=0.00680, 2500=0.00590 (USD); Case/Package: 0805; Case Code (Imperial): 0805; Case Code (Metric): 2012; Contact Plating: Tin,Matte,Lead; Min Operating Temperature: -55°C; Max Operating Temperature: 155°C; Packaging: Tape and Reel; Features: Moisture Resistant; Series: RC; Voltage Rating: 150V; Termination: SMD/SMT; Resistor Type: Thick Film; Number of Terminations: 2; Max Power Dissipation: 125mW; Construction: Rectangular; Working Voltage: 150V; Technology: THICK FILM; Length: 2mm; Depth: 1.25mm; Radiation Hardening: No; Lead Free: Lead Free; RoHS Compliant: Yes; Military Standard: Not; ComponentLink1URL: https://datasheet.ciiva.com/16741/rc0805-16741467.pdf?src-supplier=Future+Electronics; ComponentLink1Description: https://datasheet.ciiva.com/16741/rc0805-16741467.pdf?src-supplier=Future+Electronics; Supplier Part Number 1: 311-825CRCT-ND
Vref_2 = MAX6037AAUKADJ+T: IC VREF SERIES ADJ 0.2% SOT23-5; Manufacturer: Maxim; Output Voltage: 5V; Max Input Voltage: 5.5V; Max Output Current: 5mA; Operating Supply Current: 250uA; Min Output Voltage: 1.184V; Temperature Coefficient: 25ppm/°C; Reference Type: Series,Adjustable; Output Type: Adjustable; Supplier 1: Digi-Key; RoHS: Yes; Category: Voltage References; Mount: Surface Mount; Case/Package: SOT-23-5; Number of Pins: 5; Weight: 0.001058oz; Min Operating Temperature: -40°C; Max Operating Temperature: 125°C; Packaging: Tape and Reel; Package Quantity: 1; Max Output Voltage: 5V; Max Supply Current: 250uA; Output Current: 5mA; Reference Voltage: 5V; Series: -; Radiation Hardening: No; REACH SVHC: Unknown; Lead Free: Lead Free; RoHS Compliant: Yes; ComponentLink1URL: https://datasheet.ciiva.com/2008/max6037-max6037c-2008462.pdf?src-supplier=Digi-Key; ComponentLink1Description: https://datasheet.ciiva.com/2008/max6037-max6037c-2008462.pdf?src-supplier=Digi-Key; ComponentLink2URL: https://datasheet.ciiva.com/2008/max6037-max6037c-2008463.pdf?src-supplier=Digi-Key; ComponentLink2Description: https://datasheet.ciiva.com/2008/max6037-max6037c-2008463.pdf?src-supplier=Digi-Key; ComponentLink3URL: https://datasheet.ciiva.com/2008/max6037-max6037c-2008461.pdf?src-supplier=Digi-Key; ComponentLink3Description: https://datasheet.ciiva.com/2008/max6037-max6037c-2008461.pdf?src-supplier=Digi-Key; Supplier Part Number 1: MAX6037AAUKADJ+TCT-ND; Manufacturer Part Number: MAX6037AAUKADJ+T